# EAGLE design single-apa102c (EAGLE 9.6.2)

## Sheet 1 of 2
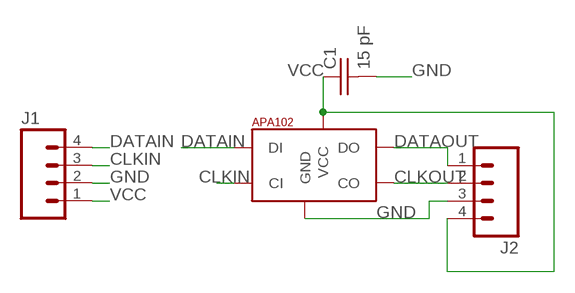
[diagram p0: schematic, sheet 1]

### Parts
C1  15 pF  C-USC0805K  [C0805K]
J1  M04PTH  [1X04]
J2  M04PTH  [1X04]
U$1  APA1025050  [APA102_5050]

### Nets
CLKIN: J1.3 U$1.5(CI)
CLKOUT: J2.2 U$1.2(CO)
DATAIN: J1.4 U$1.4(DI)
DATAOUT: J2.1 U$1.3(DO)
GND: C1.2 J1.2 J2.3 U$1.6(GND)
VCC: C1.1 J1.1 J2.4 U$1.1(VCC)

## Sheet 2 of 2
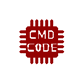
[diagram p1: schematic, sheet 2]

### Parts
U$2  CMD_C0DE_LOGOCMD_CODE_LOGO_SILK  [CMD_C0DE_LOGO_SILK]

## Library data of the parts
C1 = passives:C-US: CAPACITOR, American symbol
J1 J2 = connector:M04: Header 4 Standard 4-pin 0.1" header. Use with straight break away headers (SKU : PRT-00116), right angle break away headers (PRT-00553), swiss pins (PRT-00743), machine pins (PRT-00117), and female headers (PRT-00115). Molex polarized connector foot print use with SKU : PRT-08231 with associated crimp pins and housings. 1MM SMD Version SKU: PRT-10208; PROD_ID: CONN-09696
U$1 = leds:APA102: APA102C 5050 RGB LED -- Adafruit DotStar Single LED Pixel Product Page: https://www.adafruit.com/products/2343 Datasheet: https://cdn-shop.adafruit.com/product-files/2343/APA102C.pdf
U$2 = logos:CMD_C0DE_LOGO

## Board
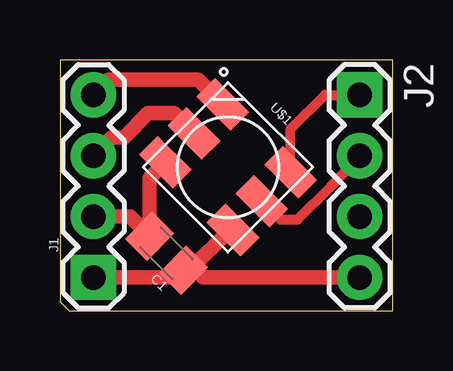
[diagram p2: board, top side]
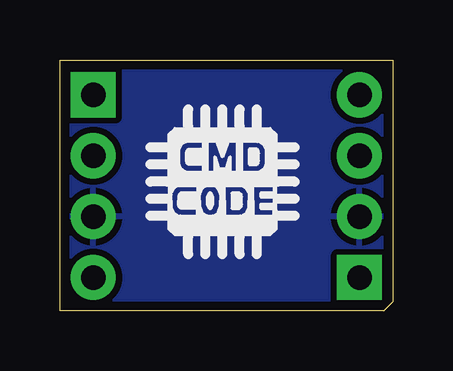
[diagram p3: board, bottom side, seen from below]

Size 13.89 x 10.48 mm. Coordinates in mm from the lower left corner, seen from the top.
Outline: 0.38,0 13.89,0 13.89,10.48 0,10.48 0,0.38 0.38,0
Copper layers (1*16): Top 0.035559375mm / dielectric 1.6mm / Bottom 0.035559375mm
Design rules "oshpark-2layer": minimum track width 6mil, minimum drill 10mil, track to track 6mil, track to pad 6mil, pad to pad 6mil, via to via 6mil, smd to smd 6mil, copper to edge 15mil, drill to drill 6mil, minimum pad ring 5mil, minimum via ring 5mil, stop-mask expansion 2.5mil, vias tented up to drill 0mil, thermal gap 10mil

### Footprints (pad centres in the part's own frame; a part is rotated, then mirrored left to right if it is on the bottom)
C0805K = smd 1.3 x 1.6: 1 -1,0; 2 1,0
1X04 = drill 1.016 pad 1.88 square: 1 0,0 | drill 1.016 pad 1.88: 2 2.54,0; 3 5.08,0; 4 7.62,0
APA102_5050 = smd 2 x 1.1: 1 2,-1.7; 2 2,0; 3 2,1.7; 4 -2,1.7; 5 -2,0; 6 -2,-1.7

### Placement (x,y rotation side)
C1  4.45,2.41 135 top
J1  1.4,1.4 90 top
J2  12.5,9.02 270 top
U$1  7.01,6 315 top
U$2  7.11,5.71 0 bottom

### Tracks (layer width: path | path; a pad name or v marks a point on that pad's centre or on a via)
CLKIN
  Top 0.61: J1.3 2.16,7.24 2.67,7.24 3.68,8.26 4.75,8.26 U$1.5
CLKOUT
  Top 0.406: U$1.2 9.2,3.81 9.91,3.81 11.32,5.22 11.32,5.23 J2.2
DATAIN
  Top 0.61: J1.4 2.03,9.65 5.76,9.65 U$1.4
DATAOUT
  Top 0.406: U$1.3 9.62,7.59 11.05,9.02 J2.1
GND
  Top 0.61: J1.2 2.92,3.94 C1.2 3.74,5.56 U$1.6
  pour Bottom (isolate 0.254): 0,10.16 0,0 13.97,0 13.97,10.16 13.97,10.54 0.13,10.54 0,10.41
VCC
  Top 0.61: J1.1 4.84,1.4 C1.1 | C1.1 5.41,1.71 7.08,3.38 | C1.1 5.66,1.71 5.97,1.4 J2.4
  Top 0.813: 7.08,3.38 U$1.1